# Altium schematic sheet Top Level.SchDoc
size A
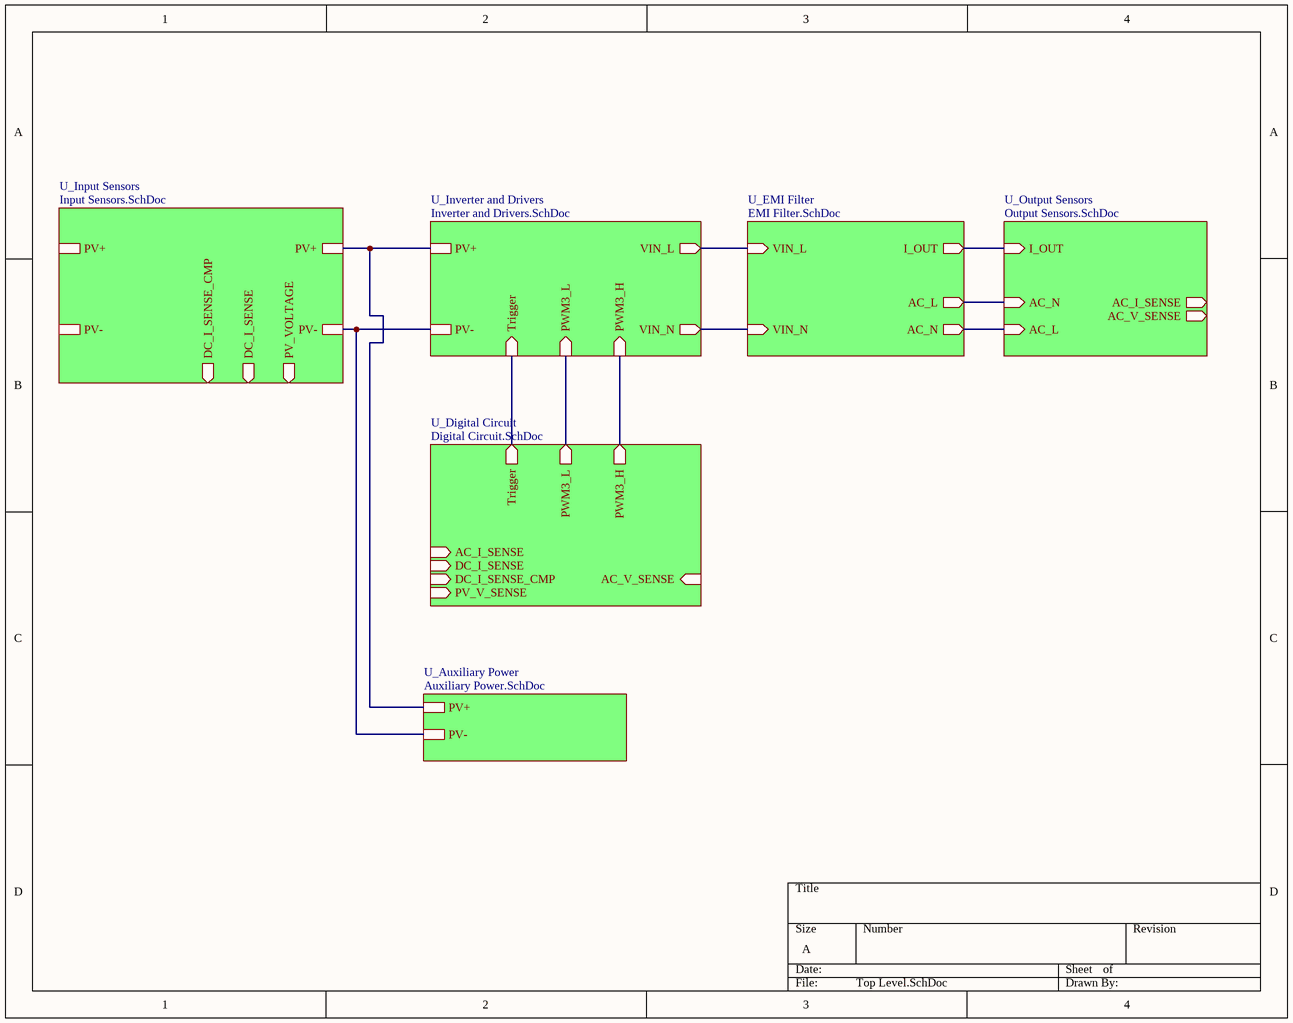
[diagram p0: Top Level.SchDoc]

## Sub-sheets
U_Auxiliary Power = Auxiliary Power.SchDoc: PV-, PV+
U_Digital Circuit = Digital Circuit.SchDoc: PWM3_L (out), PWM3_H (out), Trigger (out), AC_I_SENSE (in), DC_I_SENSE (in), DC_I_SENSE_CMP (in), PV_V_SENSE (in), AC_V_SENSE (in)
U_EMI Filter = EMI Filter.SchDoc: VIN_L (in), VIN_N (in), I_OUT (out), AC_L (out), AC_N (out)
U_Input Sensors = Input Sensors.SchDoc: PV_VOLTAGE (out), PV-, DC_I_SENSE (out), DC_I_SENSE_CMP (out), PV+, PV+, PV-
U_Inverter and Drivers = Inverter and Drivers.SchDoc: VIN_L (out), VIN_N (out), Trigger (in), PWM3_L (in), PWM3_H (in), PV+, PV-
U_Output Sensors = Output Sensors.SchDoc: I_OUT (in), AC_N (in), AC_L (in), AC_I_SENSE (out), AC_V_SENSE (out)

## Nets
(unnamed): sheet U_Inverter and Drivers/VIN_L, sheet U_EMI Filter/VIN_L
(unnamed): sheet U_Inverter and Drivers/VIN_N, sheet U_EMI Filter/VIN_N
(unnamed): sheet U_Inverter and Drivers/Trigger, sheet U_Digital Circuit/Trigger
(unnamed): sheet U_Inverter and Drivers/PWM3_L, sheet U_Digital Circuit/PWM3_L
(unnamed): sheet U_Inverter and Drivers/PWM3_H, sheet U_Digital Circuit/PWM3_H
(unnamed): sheet U_Inverter and Drivers/PV+, sheet U_Input Sensors/PV+, sheet U_Auxiliary Power/PV+
(unnamed): sheet U_Inverter and Drivers/PV-, sheet U_Input Sensors/PV-, sheet U_Auxiliary Power/PV-
(unnamed): sheet U_Output Sensors/I_OUT, sheet U_EMI Filter/I_OUT
(unnamed): sheet U_Output Sensors/AC_N, sheet U_EMI Filter/AC_L
(unnamed): sheet U_Output Sensors/AC_L, sheet U_EMI Filter/AC_N